# EAGLE design ESFDv1 (EAGLE 9.6.2)
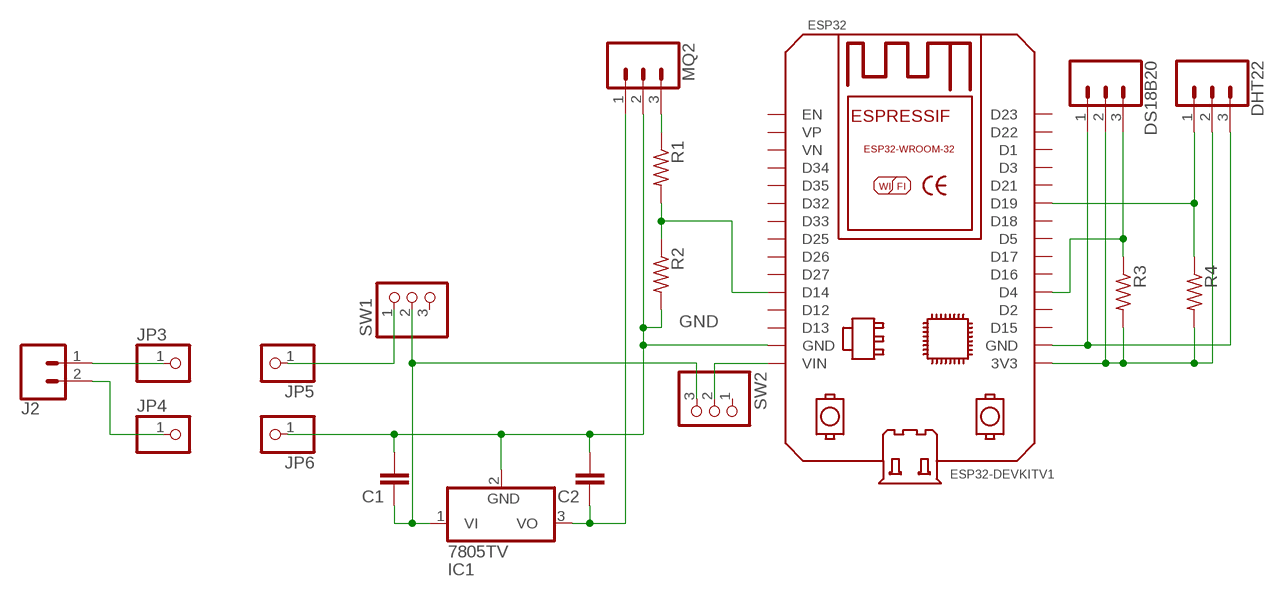
[diagram p0: schematic, sheet 1]

## Parts
C1  C5/2.5  [C5B2.5]
C2  C5/2.5  [C5B2.5]
DHT22  CONN_03-SCREW-5MM  [SCREWTERMINAL-5MM-3]
DS18B20  CONN_03-SCREW-5MM  [SCREWTERMINAL-5MM-3]
ESP32  ESP32DEVKITV1  [ESP32-DEVKITV1]
IC1  7805TV  [TO220V]
J2  CONN_025MM  [SCREWTERMINAL-5MM-2]
JP3  PINHD-1X1  [1X01]
JP4  PINHD-1X1  [1X01]
JP5  PINHD-1X1  [1X01]
JP6  PINHD-1X1  [1X01]
MQ2  CONN_03-SCREW-5MM  [SCREWTERMINAL-5MM-3]
R1  R-US_0309/12  [0309/12]
R2  R-US_0309/12  [0309/12]
R3  R-US_0414/15  [0414/15]
R4  R-US_0414/15  [0414/15]
SW1  PINHD-1X3  [1X03]
SW2  PINHD-1X3  [1X03]

## Nets
3.3V: DHT22.2 DS18B20.2 ESP32.3V3 R3.2 R4.2
D_DHT22: DHT22.1 ESP32.D19 R4.1
D_DS18B20: DS18B20.3 ESP32.D4 R3.1
GND: C1.2 C2.2 DHT22.3 DS18B20.1 ESP32.GND ESP32.GND@1(GND) IC1.2(GND) JP6.1 MQ2.2 R2.2
N$1: J2.1 JP3.1
N$2: J2.2 JP4.1
N$3: JP5.1 SW1.1
N$5: MQ2.3 R1.1
N$6: ESP32.D14 R1.2 R2.1
N$7: C1.1 IC1.1(VI) SW1.2 SW2.3
N$8: ESP32.VIN SW2.2
N$10: C2.1 IC1.3(VO) MQ2.1
Unconnected: ESP32.D1 ESP32.D2 ESP32.D3 ESP32.D5 ESP32.D12 ESP32.D13 ESP32.D15 ESP32.D16 ESP32.D17 ESP32.D18 ESP32.D21 ESP32.D22 ESP32.D23 ESP32.D25 ESP32.D26 ESP32.D27 ESP32.D32 ESP32.D33 ESP32.D34 ESP32.D35 ESP32.EN ESP32.VN ESP32.VP SW1.3 SW2.1

## Library data of the parts
C1 C2 = capacitor-wima:C: CAPACITOR naming: grid - package width
DHT22 DS18B20 MQ2 = SparkFun-Connectors:CONN_03: Multi connection point. Often used as Generic Header-pin footprint for 0.1 inch spaced/style header connections On any of the 0.1 inch spaced packages, you can populate with these: Break Away Headers - Straight <https://www.sparkfun.com/products/116> (PRT-00116) Break Away Male Headers - Right Angle <https://www.sparkfun.com/products/553> (PRT-00553) Female Headers <https://www.sparkfun.com/products/115> (PRT-00115) Break Away Headers - Machine Pin <https://www.sparkfun.com/products/117> (PRT-00117) Break Away Female Headers - Swiss Machine Pin <https://www.sparkfun.com/products/743> (PRT-00743) Stackable Header - 3 Pin (Female, 0.1") <https://www.sparkfun.com/products/13875> (PRT-13875) For SCREWTERMINALS and SPRING TERMINALS visit here: Screw Terimnals on SparkFun.com <https://www.sparkfun.com/search/results?term=Screw+Terminals> (5mm/3.5mm/2.54mm spacing) This device is also useful as a general connection point to wire up your design to another part of your project. Our various solder wires solder well into these plated through hole pads. Hook-Up Wire - Assortment (Stranded, 22 AWG) <https://www.sparkfun.com/products/11375> (PRT-11375) Hook-Up Wire - Assortment (Solid Core, 22 AWG) <https://www.sparkfun.com/products/11367> (PRT-11367) View the entire wire category on our website here <https://www.sparkfun.com/categories/141> Special notes: Molex polarized connector foot print use with SKU : PRT-08232 with associated crimp pins and housings.; PROD_ID: CONN-10134; SF_SKU: PRT-08433
ESP32 = ESP32-DEVKITV1:ESP32DEVKITV1: https://github.com/shridattdudhat
IC1 = linear:78*: Positive VOLTAGE REGULATOR Source: http://cache.national.com/ds/LM/LM78L05.pdf http://www.fairchildsemi.com/ds/LM/LM7805.pdf
J2 = SparkFun-Connectors:CONN_02: Multi connection point. Often used as Generic Header-pin footprint for 0.1 inch spaced/style header connections On any of the 0.1 inch spaced packages, you can populate with these: Break Away Headers - Straight <https://www.sparkfun.com/products/116> (PRT-00116) Break Away Male Headers - Right Angle <https://www.sparkfun.com/products/553> (PRT-00553) Female Headers <https://www.sparkfun.com/products/115> (PRT-00115) Break Away Headers - Machine Pin <https://www.sparkfun.com/products/117> (PRT-00117) Break Away Female Headers - Swiss Machine Pin <https://www.sparkfun.com/products/743> (PRT-00743) For SCREWTERMINALS and SPRING TERMINALS visit here: Screw Terimnals on SparkFun.com <https://www.sparkfun.com/search/results?term=Screw+Terminals> (5mm/3.5mm/2.54mm spacing) This device is also useful as a general connection point to wire up your design to another part of your project. Our various solder wires solder well into these plated through hole pads. Hook-Up Wire - Assortment (Stranded, 22 AWG) <https://www.sparkfun.com/products/11375> (PRT-11375) Hook-Up Wire - Assortment (Solid Core, 22 AWG) <https://www.sparkfun.com/products/11367> (PRT-11367) View the entire wire category on our website here <https://www.sparkfun.com/categories/141> Special notes: Molex polarized connector foot print use with: PRT-08233 with associated crimp pins and housings. 2.54_SCREWTERM for use with PRT-10571. 3.5mm Screw Terminal footprints for PRT-08084 5mm Screw Terminal footprints for use with PRT-08432; SF_SKU: PRT-08432
JP3-JP6 = pinhead:PINHD-1X1: PIN HEADER
R1-R4 = rcl:R-US_: RESISTOR, American symbol; SPICEPREFIX: R
SW1 SW2 = pinhead:PINHD-1X3: PIN HEADER

## Board
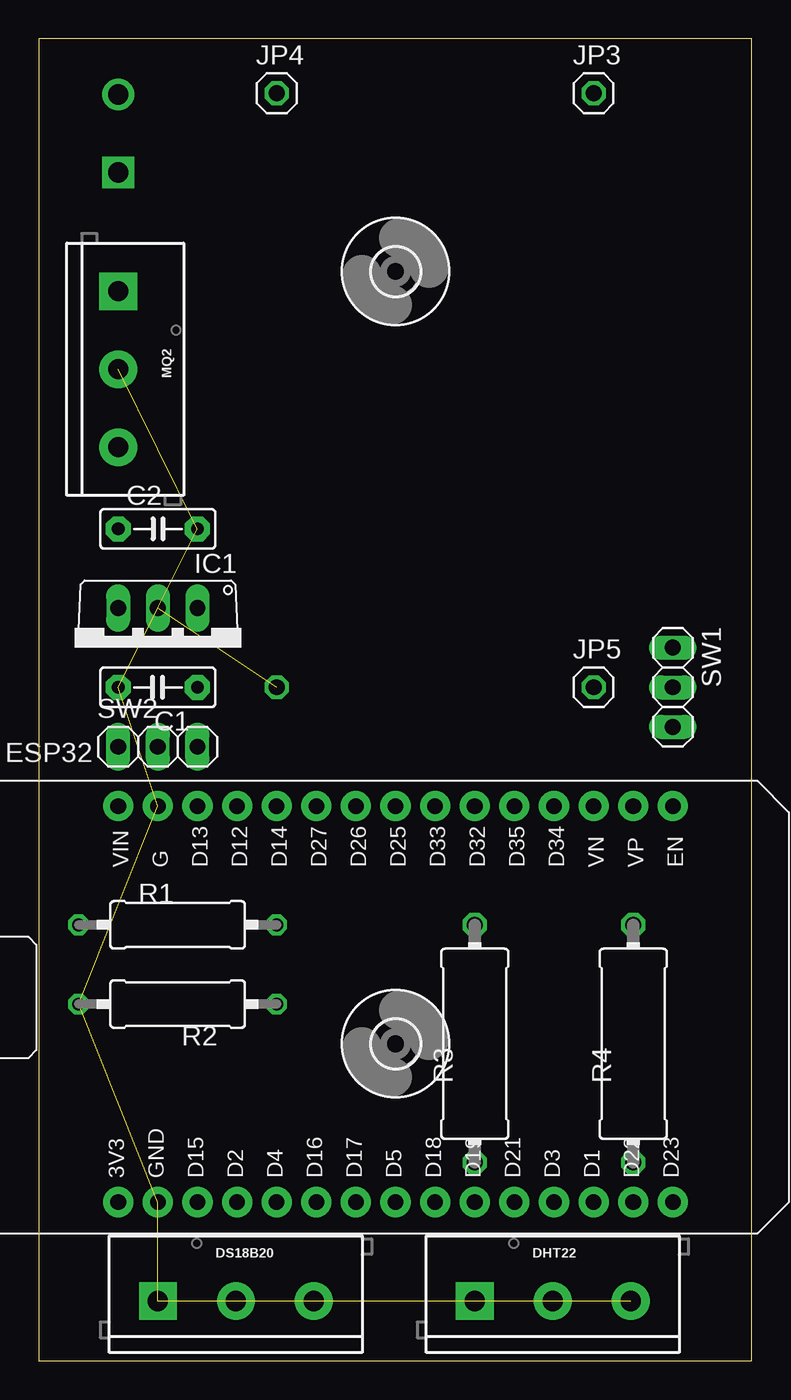
[diagram p1: board, top side]
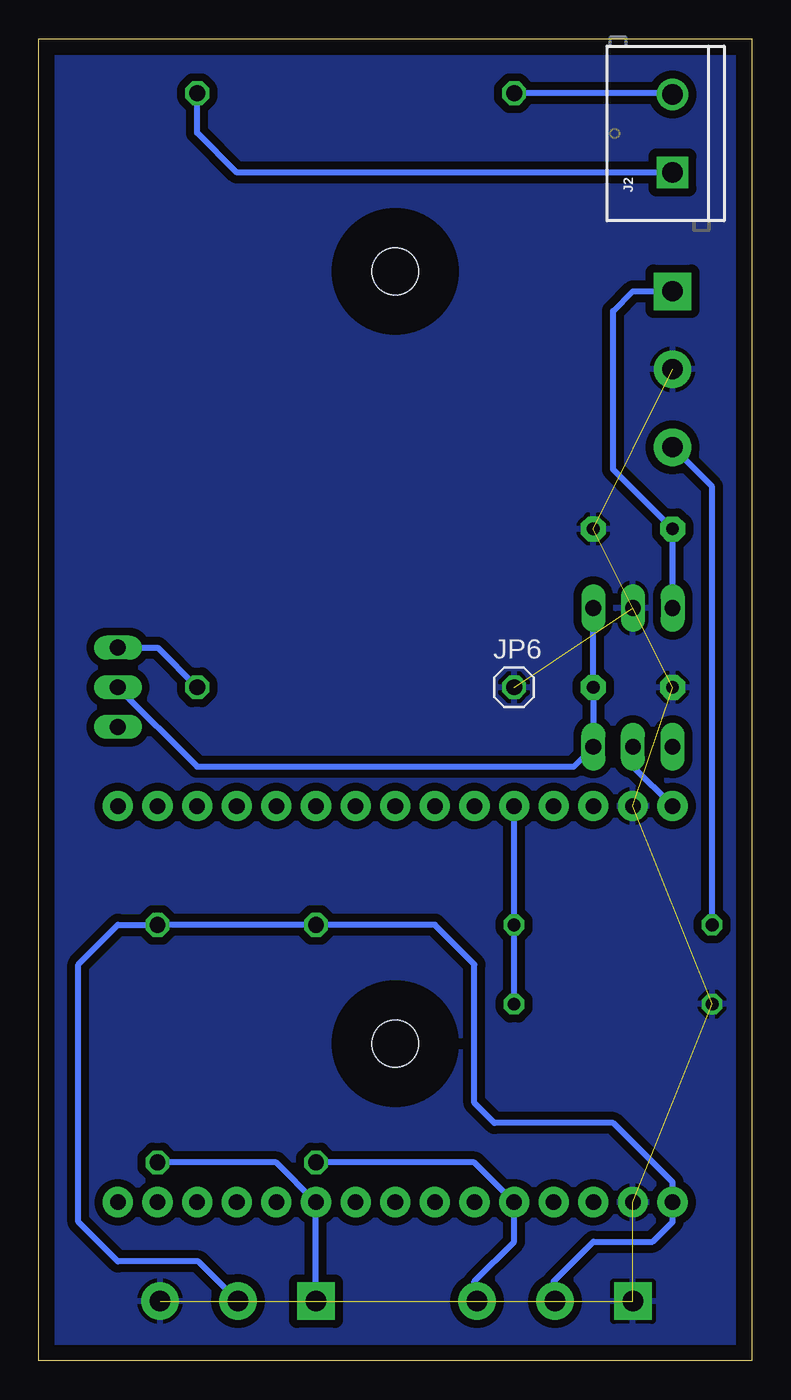
[diagram p2: board, bottom side, seen from below]

Size 45.7 x 84.76 mm. Coordinates in mm from the lower left corner, seen from the top.
Outline: 0,84.76 0,0 45.7,0 45.7,84.76 0,84.76
Copper layers (1*16): Top 0.035mm / dielectric 1.5mm / Bottom 0.035mm
Design rules "default *": minimum track width 6mil, minimum drill 0.35mm, track to track 20mil, track to pad 6mil, pad to pad 6mil, via to via 6mil, smd to smd 6mil, copper to edge 40mil, drill to drill 6mil, minimum pad ring 10mil, minimum via ring 8mil, stop-mask expansion 4mil, vias tented up to drill 0mil, thermal gap 10mil

### Footprints (pad centres in the part's own frame; a part is rotated, then mirrored left to right if it is on the bottom)
C5B2.5 = drill 0.813 pad 1.6 octagon: 1 -2.54,0; 2 2.54,0
SCREWTERMINAL-5MM-3 = drill 1.3 pad 2.413 square: 1 0,0 | drill 1.3 pad 2.413: 2 5,0; 3 10,0
ESP32-DEVKITV1 = drill 1 pad 1.93: 3V3 0,0; D1 30.48,0; D2 7.62,0; D3 27.94,0; D4 10.16,0; D5 17.78,0; D12 7.62,25.4; D13 5.08,25.4; D14 10.16,25.4; D15 5.08,0; D16 12.7,0; D17 15.24,0; D18 20.32,0; D19 22.86,0; D21 25.4,0; D22 33.02,0; D23 35.56,0; D25 17.78,25.4; D26 15.24,25.4; D27 12.7,25.4; D32 22.86,25.4; D33 20.32,25.4; D34 27.94,25.4; D35 25.4,25.4; EN 35.56,25.4; GND 2.54,25.4; GND@1 2.54,0; VIN 0,25.4; VN 30.48,25.4; VP 33.02,25.4
TO220V = drill 1.016 long: 1 -2.54,-2.54; 2 0,-2.54; 3 2.54,-2.54
SCREWTERMINAL-5MM-2 = drill 1.3 pad 2.032 square: 1 0,0 | drill 1.3 pad 2.032: 2 5,0
1X01 = drill 1.016 octagon: 1 0,0
0309/12 = drill 0.813 octagon: 1 -6.35,0; 2 6.35,0
0414/15 = drill 1.016 octagon: 1 -7.62,0; 2 7.62,0
1X03 = drill 1.016 long: 1 -2.54,0; 2 0,0; 3 2.54,0
3,0 = hole 3: 0,0

### Placement (x,y rotation side)
C1  7.62,43.18 180 top
C2  7.62,53.34 0 top
DHT22  27.94,3.81 0 top
DS18B20  7.62,3.81 0 top
ESP32  5.08,10.16 0 top
IC1  7.62,45.72 180 top
J2  5.08,76.2 90 bottom
JP3  35.56,81.28 0 top
JP4  15.24,81.28 0 top
JP5  35.56,43.18 0 top
JP6  15.24,43.18 0 bottom
MQ2  5.08,68.58 270 top
R1  8.89,27.94 0 top
R2  8.89,22.86 180 top
R3  27.94,20.32 90 top
R4  38.1,20.32 90 top
SW1  40.64,43.18 270 top
SW2  7.62,39.37 0 top
U$1  [3,0]  22.86,20.32 0 top
U$2  [3,0]  22.86,69.85 0 top

### Tracks (layer width: path | path; a pad name or v marks a point on that pad's centre or on a via)
3.3V
  Bottom 0.4: DHT22.2 35.48,6.35 40.64,6.35 43.18,8.89 43.18,25.4 40.64,27.94 R4.2 R3.2 20.32,27.94 17.78,25.4 17.78,16.51 16.51,15.24 8.89,15.24 5.08,11.43 ESP32.3V3 5.08,8.89 6.35,7.62 10.16,7.62 12.7,5.08 12.7,3.89 DS18B20.2
D_DHT22
  Bottom 0.4: DHT22.1 ESP32.D19 30.48,12.7 R4.1
D_DS18B20
  Bottom 0.4: DS18B20.3 17.78,3.97 17.78,5.08 15.24,7.62 ESP32.D4 17.78,12.7 R3.1
GND  (9 unrouted)
  pour Bottom: 0,83.82 0,0 45.72,0 45.72,83.82
N$1
  Bottom 0.4: J2.1 33.02,76.2 35.56,78.74 JP3.1
N$2
  Bottom 0.4: J2.2 5.16,81.28 JP4.1
N$3
  Bottom 0.4: SW1.1 38.1,45.72 JP5.1
N$5
  Bottom 0.4: MQ2.3 2.54,56.04 R1.1
N$6
  Bottom 0.4: R2.1 R1.2 ESP32.D14
N$7
  Bottom 0.4: SW1.2 35.56,38.1 11.43,38.1 SW2.3 C1.1 IC1.1
N$8
  Bottom 0.4: SW2.2 7.62,38.1 ESP32.VIN
N$10
  Bottom 0.4: IC1.3 C2.1 8.89,57.15 8.89,67.31 7.62,68.58 MQ2.1